# Altium schematic sheet Allproject.SchDoc
size 420 x 297 mm; SheetNumber: 1; SheetTotal: 1
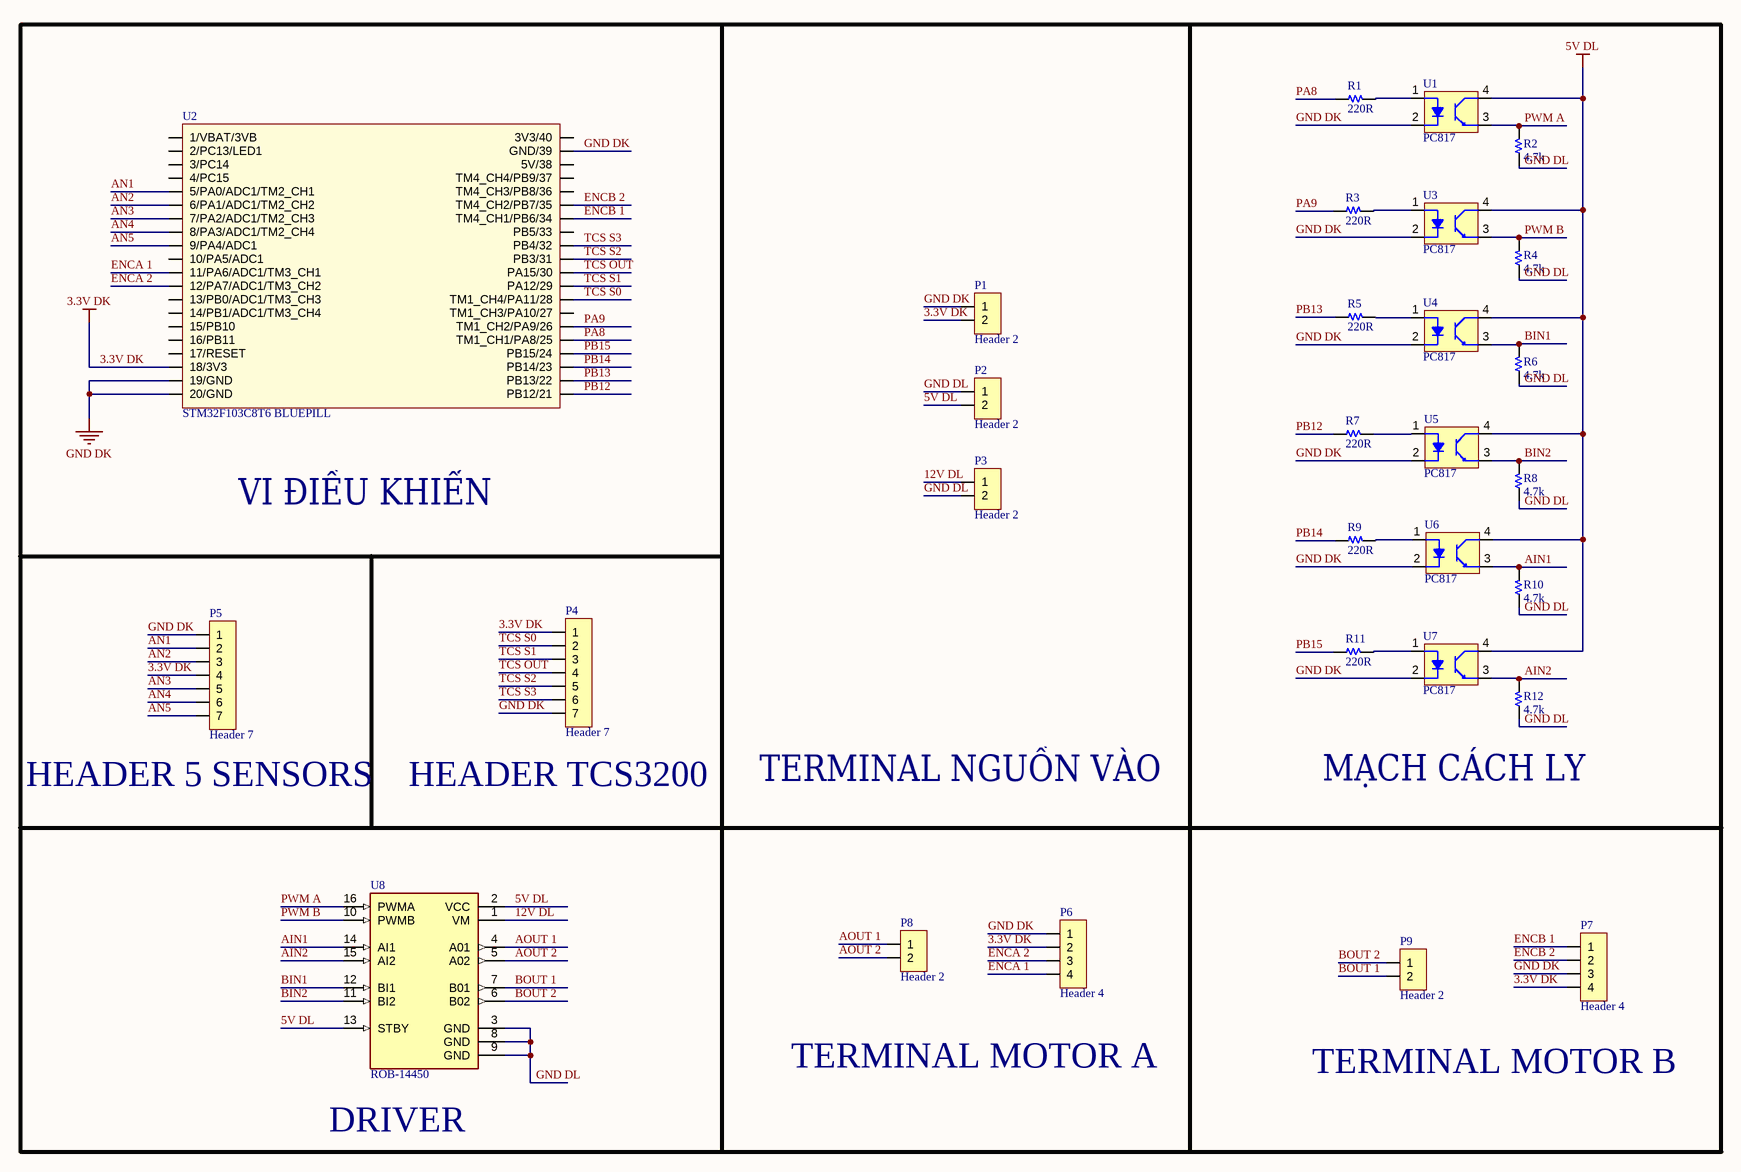
[diagram p0: Allproject.SchDoc]

## Parts
P1  Header 2  [HDR/Terminal/2]
P2  Header 2  [HDR/Terminal/2]
P3  Header 2  [HDR/Terminal/2]
P4  Header 7  [HDR/Header/7]
P5  Header 7  [HDR/Header/7]
P6  Header 4  [HDR/Terminal/4]
P7  Header 4  [HDR/Terminal/4]
P8  Header 2  [HDR/Terminal/2]
P9  Header 2  [HDR/Terminal/2]
R1  220R  [R 1/4W/300]
R2  4.7k  [R 1/4W/300]
R3  220R  [R 1/4W/300]
R4  4.7k  [R 1/4W/300]
R5  220R  [R 1/4W/300]
R6  4.7k  [R 1/4W/300]
R7  220R  [R 1/4W/300]
R8  4.7k  [R 1/4W/300]
R9  220R  [R 1/4W/300]
R10  4.7k  [R 1/4W/300]
R11  220R  [R 1/4W/300]
R12  4.7k  [R 1/4W/300]
U1  PC817  [DIP4 - PC817]
U2  STM32F103C8T6 BLUEPILL  [Female header 20x20 pin]
U3  PC817  [DIP4 - PC817]
U4  PC817  [DIP4 - PC817]
U5  PC817  [DIP4 - PC817]
U6  PC817  [DIP4 - PC817]
U7  PC817  [DIP4 - PC817]
U8  ROB-14450  [MODULE_ROB-14450]

## Nets
3.3V DK: P1.2 P4.1 P5.4 P6.2 P7.4 U2.18(18/3V3)
5V DL: P2.2 U1.4(C) U3.4(C) U4.4(C) U5.4(C) U6.4(C) U7.4(C) U8.2(VCC) U8.13(STBY)
GND DK: P1.1 P4.7 P5.1 P6.1 P7.3 U1.2(K) U2.19(19/GND) U2.20(20/GND) U2.39(GND/39) U3.2(K) U4.2(K) U5.2(K) U6.2(K) U7.2(K)
12V DL: P3.1 U8.1(VM)
AIN1: R10.2 U6.3(E) U8.14(AI1)
AIN2: R12.2 U7.3(E) U8.15(AI2)
AN1: P5.2 U2.5(5/PA0/ADC1/TM2_CH1)
AN2: P5.3 U2.6(6/PA1/ADC1/TM2_CH2)
AN3: P5.5 U2.7(7/PA2/ADC1/TM2_CH3)
AN4: P5.6 U2.8(8/PA3/ADC1/TM2_CH4)
AN5: P5.7 U2.9(9/PA4/ADC1)
AOUT 1: P8.1 U8.4(A01)
AOUT 2: P8.2 U8.5(A02)
BIN1: R6.2 U4.3(E) U8.12(BI1)
BIN2: R8.2 U5.3(E) U8.11(BI2)
BOUT 1: P9.2 U8.7(B01)
BOUT 2: P9.1 U8.6(B02)
ENCA 1: P6.4 U2.11(11/PA6/ADC1/TM3_CH1)
ENCA 2: P6.3 U2.12(12/PA7/ADC1/TM3_CH2)
ENCB 1: P7.1 U2.34(TM4_CH1/PB6/34)
ENCB 2: P7.2 U2.35(TM4_CH2/PB7/35)
GND DL: P2.1 P3.2 R2.1 R4.1 R6.1 R8.1 R10.1 R12.1 U8.3(GND) U8.8(GND) U8.9(GND)
PA8: R1.1 U2.25(TM1_CH1/PA8/25)
PA9: R3.1 U2.26(TM1_CH2/PA9/26)
PB12: R7.1 U2.21(PB12/21)
PB13: R5.1 U2.22(PB13/22)
PB14: R9.1 U2.23(PB14/23)
PB15: R11.1 U2.24(PB15/24)
PWM A: R2.2 U1.3(E) U8.16(PWMA)
PWM B: R4.2 U3.3(E) U8.10(PWMB)
TCS OUT: P4.4 U2.30(PA15/30)
TCS S0: P4.2 U2.28(TM1_CH4/PA11/28)
TCS S1: P4.3 U2.29(PA12/29)
TCS S2: P4.5 U2.31(PB3/31)
TCS S3: P4.6 U2.32(PB4/32)
NetR1_2: R1.2 U1.1(A)
NetR3_2: R3.2 U3.1(A)
NetR5_2: R5.2 U4.1(A)
NetR7_2: R7.2 U5.1(A)
NetR9_2: R9.2 U6.1(A)
NetR11_2: R11.2 U7.1(A)

Not connected (* = marked no-connect by the designer): U2 1(1/VBAT/3VB) 2(2/PC13/LED1) 3(3/PC14) 4(4/PC15) 10(10/PA5/ADC1) 13(13/PB0/ADC1/TM3_CH3) 14(14/PB1/ADC1/TM3_CH4) 15(15/PB10) 16(16/PB11) 17(17/RESET) 27(TM1_CH3/PA10/27) 33(PB5/33) 36(TM4_CH3/PB8/36) 37(TM4_CH4/PB9/37) 38(5V/38) 40(3V3/40)

## Notes on the sheet
- VI ĐIỀU KHIỂN
- (near P5) HEADER 5 SENSORS
- (near P4) HEADER TCS3200
- TERMINAL NGUỒN VÀO
- (near R12) MẠCH CÁCH LY
- TERMINAL MOTOR A
- TERMINAL MOTOR B
- (near U8) DRIVER
- THIS DOCUMENT AND THE DATA DISCLOSED HEREIN OR
- HEREWITH IS THE PROPERTY OF ALTIUM LIMITED AND MAY
- DWG NO:
- REVISION
- REV:
- DESCRIPTION
- DATE
- APPROVED
- BE FREELY DISTRIBUTED IN WHOLE. NO RIGHTS ARE
- RESERVED OR EXPRESS OR IMPLIED WARANTEE GIVEN.
- ENG:
- APPROVALS
- PROJECT
- DSN:
- CHK:
- REFERENCE DOCUMENTS
- PROJECT REVISION:
- TITLE
- DOCUMENT REVISION:
- DESIGN ITEM:
- BOM:
- FAB DWG:
- PCB DWG:
- ASSY DWG:
- SCALE:
- A3
- SIZE
- CAGE CODE
- FILE NAME
- DWG NO.
- SHEET
- OF
- REV

## Library data of the parts
P1-P3 P8 P9 = Header 2: Header, 2-Pin
P4 P5 = Header 7: Header, 7-Pin
P6 P7 = Header 4: Header, 4-Pin
R1-R12 = Resistor
U1 U3-U7 = PC817: Opto PC817B
U2 = STM32F103C8T6 KIT BLUE PILL: Connector 9; Value: Connector 9
U8 = ROB-14450: TB6612FNG Motor Controller/Driver Power Management Evaluation Board; MF: SparkFun Electronics; Check_prices: https://www.snapeda.com/parts/ROB-14450/SparkFun%20Electronics/view-part/2656367/?ref=eda; Package: None; MP: ROB-14450; Value: *; Availability: In Stock; SnapEDA_Link: https://www.snapeda.com/parts/ROB-14450/SparkFun%20Electronics/view-part/2656367/?ref=snap; Price: None